# Altium project 18f97j60.PrjPCB
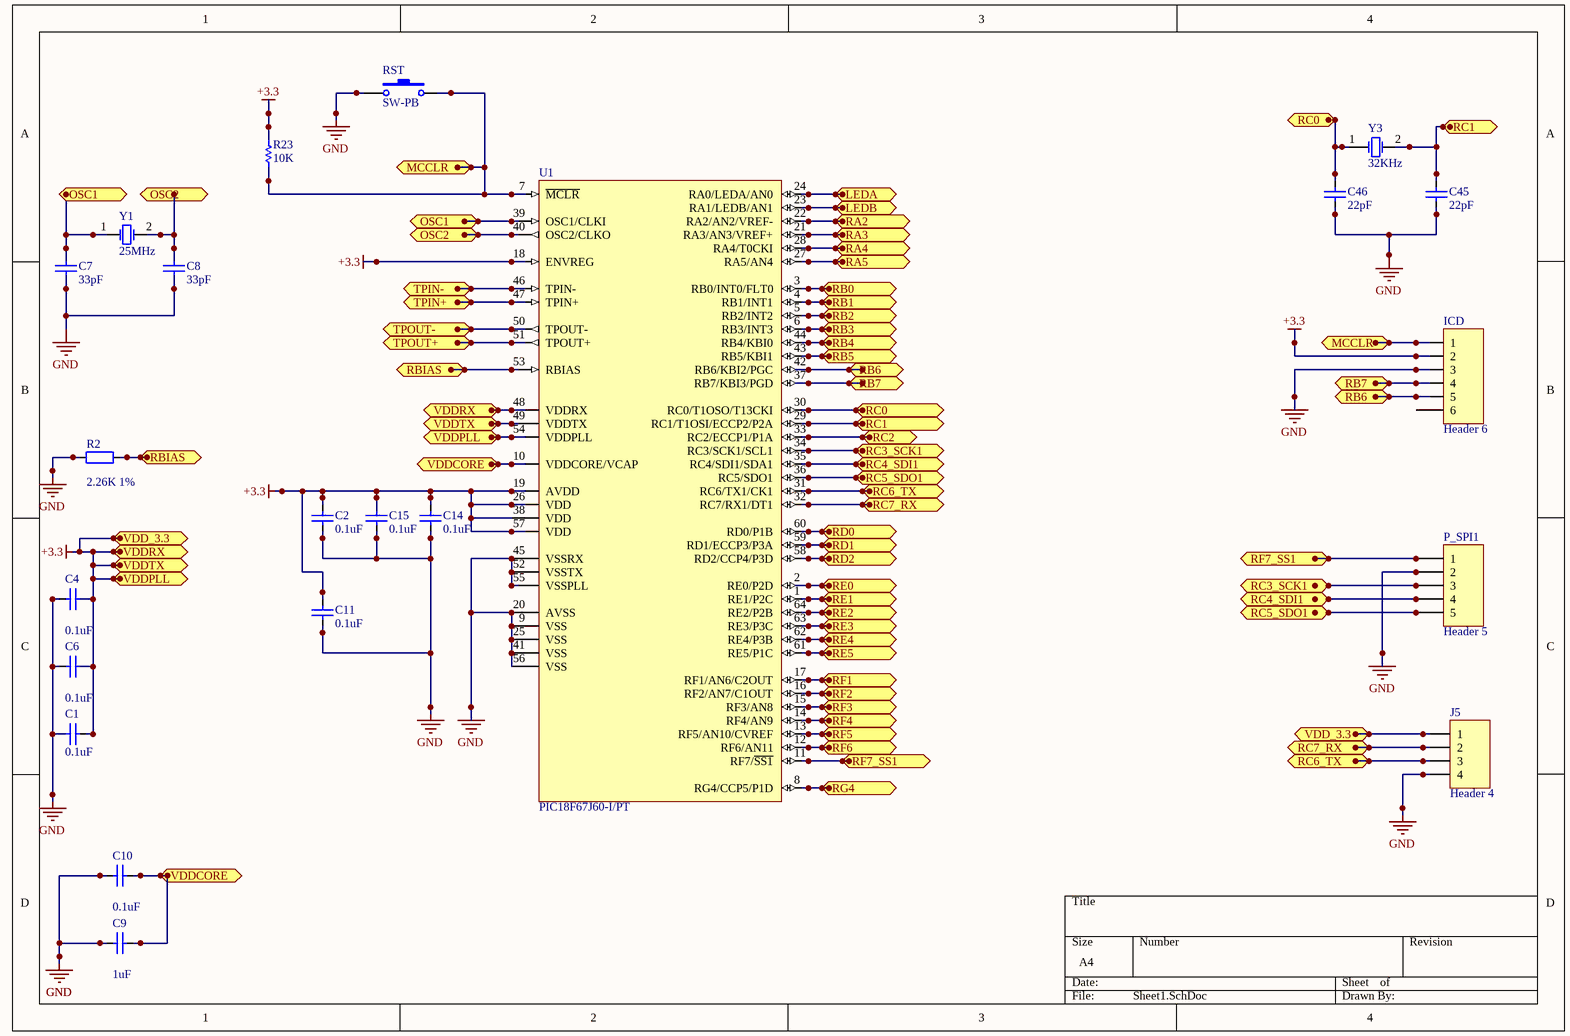
[diagram p0: Sheet1.SchDoc]
2 sheets, 55 parts. Net scope: flat (ports and power ports of the same name join across sheets).
Board file: PCB1.PcbDoc
Sheets:
  Sheet1.SchDoc
  Sheet_MAGJACK.SchDoc

## Sheet Sheet1.SchDoc
size A4

### Parts
C1  0.1uF  [CAPC2012L]
C2  0.1uF  [CAPC2012L]
C4  0.1uF  [CAPC2012L]
C6  0.1uF  [CAPC2012L]
C7  33pF  [CAPC2012L]
C8  33pF  [CAPC2012L]
C9  1uF  [CAPC2012L]
C10  0.1uF  [CAPC2012L]
C11  0.1uF  [CAPC2012L]
C14  0.1uF  [CAPC2012L]
C15  0.1uF  [CAPC2012L]
C45  22pF  [CAPC2012L]
C46  22pF  [CAPC2012L]
ICD  Header 6  [HDR1X6]
J5  Header 4  [HDR1X4]
P_SPI1  Header 5  [HDR1X5]
R2  2.26K 1%  [RESC2012L]
R23  10K  [RESC3216L]
RST  SW-PB  [SPST-2]
U1  PIC18F67J60-I/PT  [TQFP-PT64_L]
Y1  25MHz  [SPST-2]
Y3  32KHz  [BCY-W2/D3.1]

### Ports
LEDA, LEDB, MCCLR, OSC1, OSC2, RA2, RA3, RA4, RA5, RB0, RB1, RB2, RB3, RB4, RB5, RB6, RB7, RBIAS (in), RBIAS (out), RC0, RC1, RC2, RC3_SCK1, RC4_SDI1, RC5_SDO1, RC6_TX, RC7_RX, RD0, RD1, RD2, RE0, RE1, RE2, RE3, RE4, RE5, RF1, RF2, RF3, RF4, RF5, RF6, RF7_SS1, RG4, TPIN+, TPIN-, TPOUT+, TPOUT-, VDD_3.3, VDDCORE, VDDPLL, VDDRX, VDDTX

### Nets
+3.3: C1.2 C2.2 C4.2 C6.2 C11.2 C14.2 C15.2 ICD.2 J5.1 R23.2 U1.18(ENVREG) U1.19(AVDD) U1.26(VDD) U1.38(VDD) U1.48(VDDRX) U1.49(VDDTX) U1.54(VDDPLL) U1.57(VDD) ; port VDDRX, port VDDTX, port VDDPLL, port VDD_3.3
GND: C1.1 C2.1 C4.1 C6.1 C7.1 C8.1 C9.1 C10.1 C11.1 C14.1 C15.1 C45.1 C46.1 ICD.3 J5.4 P_SPI1.2 R2.1 RST.1 U1.9(VSS) U1.20(AVSS) U1.25(VSS) U1.41(VSS) U1.45(VSSRX) U1.52(VSSTX) U1.55(VSSPLL) U1.56(VSS)
NetC7_2: C7.2 Y1.1(OSC1)
NetC8_2: C8.2 Y1.2(OSC2)
NetC9_2: C9.2 C10.2 U1.10(VDDCORE/VCAP) ; port VDDCORE
NetC45_2: C45.2 U1.29(RC1/T1OSI/ECCP2/P2A) Y3.2(OSC2) ; port RC1
NetC46_2: C46.2 U1.30(RC0/T1OSO/T13CKI) Y3.1(OSC1) ; port RC0
NetICD_1: ICD.1 R23.1 RST.2 U1.7(~{MCLR}) ; port MCCLR
NetICD_4: ICD.4 U1.37(RB7/KBI3/PGD) ; port RB7
NetICD_5: ICD.5 U1.42(RB6/KBI2/PGC) ; port RB6
NetJ1_1: U1.51(TPOUT+) ; port TPOUT+
NetJ1_2: U1.50(TPOUT-) ; port TPOUT-
NetJ1_7: U1.47(TPIN+) ; port TPIN+
NetJ1_8: U1.46(TPIN-) ; port TPIN-
NetJ1_9: U1.24(RA0/LEDA/AN0) ; port LEDA
NetJ1_12: U1.23(RA1/LEDB/AN1) ; port LEDB
NetJ5_2: J5.2 U1.32(RC7/RX1/DT1) ; port RC7_RX
NetJ5_3: J5.3 U1.31(RC6/TX1/CK1) ; port RC6_TX
NetJAPORT_1: U1.21(RA3/AN3/VREF+) ; port RA3
NetJAPORT_2: U1.22(RA2/AN2/VREF-) ; port RA2
NetJAPORT_3: U1.27(RA5/AN4) ; port RA5
NetJAPORT_4: U1.28(RA4/T0CKI) ; port RA4
NetJFPORT_1: U1.17(RF1/AN6/C2OUT) ; port RF1
NetJFPORT_2: U1.16(RF2/AN7/C1OUT) ; port RF2
NetJFPORT_3: U1.15(RF3/AN8) ; port RF3
NetJFPORT_4: U1.14(RF4/AN9) ; port RF4
NetJFPORT_5: U1.13(RF5/AN10/CVREF) ; port RF5
NetJFPORT_6: U1.12(RF6/AN11) ; port RF6
NetP_M1_1: U1.63(RE3/P3C) ; port RE3
NetP_M1_2: U1.62(RE4/P3B) ; port RE4
NetP_M1_3: U1.61(RE5/P1C) ; port RE5
NetP_M1_4: U1.60(RD0/P1B) ; port RD0
NetP_M1_5: U1.59(RD1/ECCP3/P3A) ; port RD1
NetP_M1_6: U1.58(RD2/CCP4/P3D) ; port RD2
NetP_M1_7: U1.44(RB4/KBI0) ; port RB4
NetP_M1_8: U1.43(RB5/KBI1) ; port RB5
NetP_M2_1: U1.8(RG4/CCP5/P1D) ; port RG4
NetP_M2_2: U1.6(RB3/INT3) ; port RB3
NetP_M2_3: U1.5(RB2/INT2) ; port RB2
NetP_M2_4: U1.4(RB1/INT1) ; port RB1
NetP_M2_5: U1.3(RB0/INT0/FLT0) ; port RB0
NetP_M2_6: U1.2(RE0/P2D) ; port RE0
NetP_M2_7: U1.1(RE1/P2C) ; port RE1
NetP_M2_8: U1.64(RE2/P2B) ; port RE2
NetP_SPI1_1: P_SPI1.1 U1.11(RF7/~{SS1}) ; port RF7_SS1
NetP_SPI1_3: P_SPI1.3 U1.34(RC3/SCK1/SCL1) ; port RC3_SCK1
NetP_SPI1_4: P_SPI1.4 U1.35(RC4/SDI1/SDA1) ; port RC4_SDI1
NetP_SPI1_5: P_SPI1.5 U1.36(RC5/SDO1) ; port RC5_SDO1
NetR2_2: R2.2 U1.53(RBIAS) ; port RBIAS
NetR6_1: U1.33(RC2/ECCP1/P1A) ; port RC2
NetU1_39: U1.39(OSC1/CLKI) ; port OSC1
NetU1_40: U1.40(OSC2/CLKO) ; port OSC2

Not connected (* = marked no-connect by the designer): ICD 6

### Library data of the parts
C1 C45 C46 = Cap Semi: Capacitor (Semiconductor SIM Model); Published: 8-Jun-2000; LatestRevisionDate: 29-May-2009; LatestRevisionNote: IPC-7351 Footprint Added.; PackageReference: C1206; Publisher: Altium Limited; PackageDescription: Chip Capacitor
  C1: Value: 0.1uF
  C45 C46: Value: 22pF
C2 C4 C6-C11 C14 C15 = Cap: Capacitor; Published: 8-Jun-2000; LatestRevisionDate: 17-Jul-2002; LatestRevisionNote: Re-released for DXP Platform.; PackageReference: RAD-0.3; Publisher: Altium Limited
  C2 C4 C6 C10 C11 C14 C15: Value: 0.1uF
  C7 C8: Value: 33pF
  C9: Value: 1uF
ICD = Header 6: Header, 6-Pin; LatestRevisionDate: 17-Jul-2002; LatestRevisionNote: Re-released for DXP Platform.; Publisher: Altium Limited
J5 = Header 4: Header, 4-Pin; LatestRevisionDate: 17-Jul-2002; LatestRevisionNote: Re-released for DXP Platform.; Publisher: Altium Limited
P_SPI1 = Header 5: Header, 5-Pin; LatestRevisionDate: 17-Jul-2002; LatestRevisionNote: Re-released for DXP Platform.; Publisher: Altium Limited
R2 = Res2: Resistor; Published: 8-Jun-2000; LatestRevisionDate: 17-Jul-2002; LatestRevisionNote: Re-released for DXP Platform.; PackageReference: AXIAL-0.4; Publisher: Altium Limited; Value: 2.26K 1%
R23 = Res Semi: Semiconductor Resistor; Published: 8-Jun-2000; LatestRevisionDate: 17-Jul-2002; LatestRevisionNote: Re-released for DXP Platform.; PackageReference: AXIAL-0.5; Publisher: Altium Limited; Value: 10K
RST = SW-PB: Switch; Published: 24-Mar-1999; LatestRevisionDate: 17-Jul-2002; LatestRevisionNote: Re-released for DXP Platform.; PackageReference: SPST-2; Publisher: Altium Limited
U1 = PIC18F67J60-I/PT: High Performance, 1-Mbit Flash Microcontroller with Ethernet, 128K Flash, 64-Pin TQFP, Industrial Temperature Range; FirstPublished: 29-Jan-2009; LatestRevisionDate: 02-Dec-2009; LatestRevisionNote: Updated to datasheet revision E, Oct-2009; DatasheetVersion: revE, Oct-2009; PackageVersion: revBB, Aug-2009; PackageReference: TQFP-PT64; Publisher: Altium Limited; PackageDescription: 64-Lead Thin Plastic Quad Flat Pack (PT) - 10x10x1mm Body, 2.00mm [TQFP]; Supplier 1: Digi-Key; Supplier Part Number 1: PIC18F67J60-I/PT-ND; Supplier 2: Farnell; Supplier Part Number 2: 1332285; Supplier 3: Newark; Supplier Part Number 3: 56K7302; Code_JEDEC: MS-026; ComponentLink1Description: Datasheet; ComponentLink1URL: http://ww1.microchip.com/downloads/en/DeviceDoc/39762e.pdf; ComponentLink2Description: Packaging Specification; ComponentLink2URL: http://www.microchip.com/stellent/groups/techpub_sg/documents/packagingspec/en012702.pdf; ComponentLink3Description: Microchip.com Home; ComponentLink3URL: http://www.microchip.com/
Y1 Y3 = XTAL: Crystal Oscillator; Published: 8-Jun-2000; LatestRevisionDate: 17-Jul-2002; LatestRevisionNote: Re-released for DXP Platform.; PackageReference: R38; Publisher: Altium Limited

## Sheet Sheet_MAGJACK.SchDoc
size A4
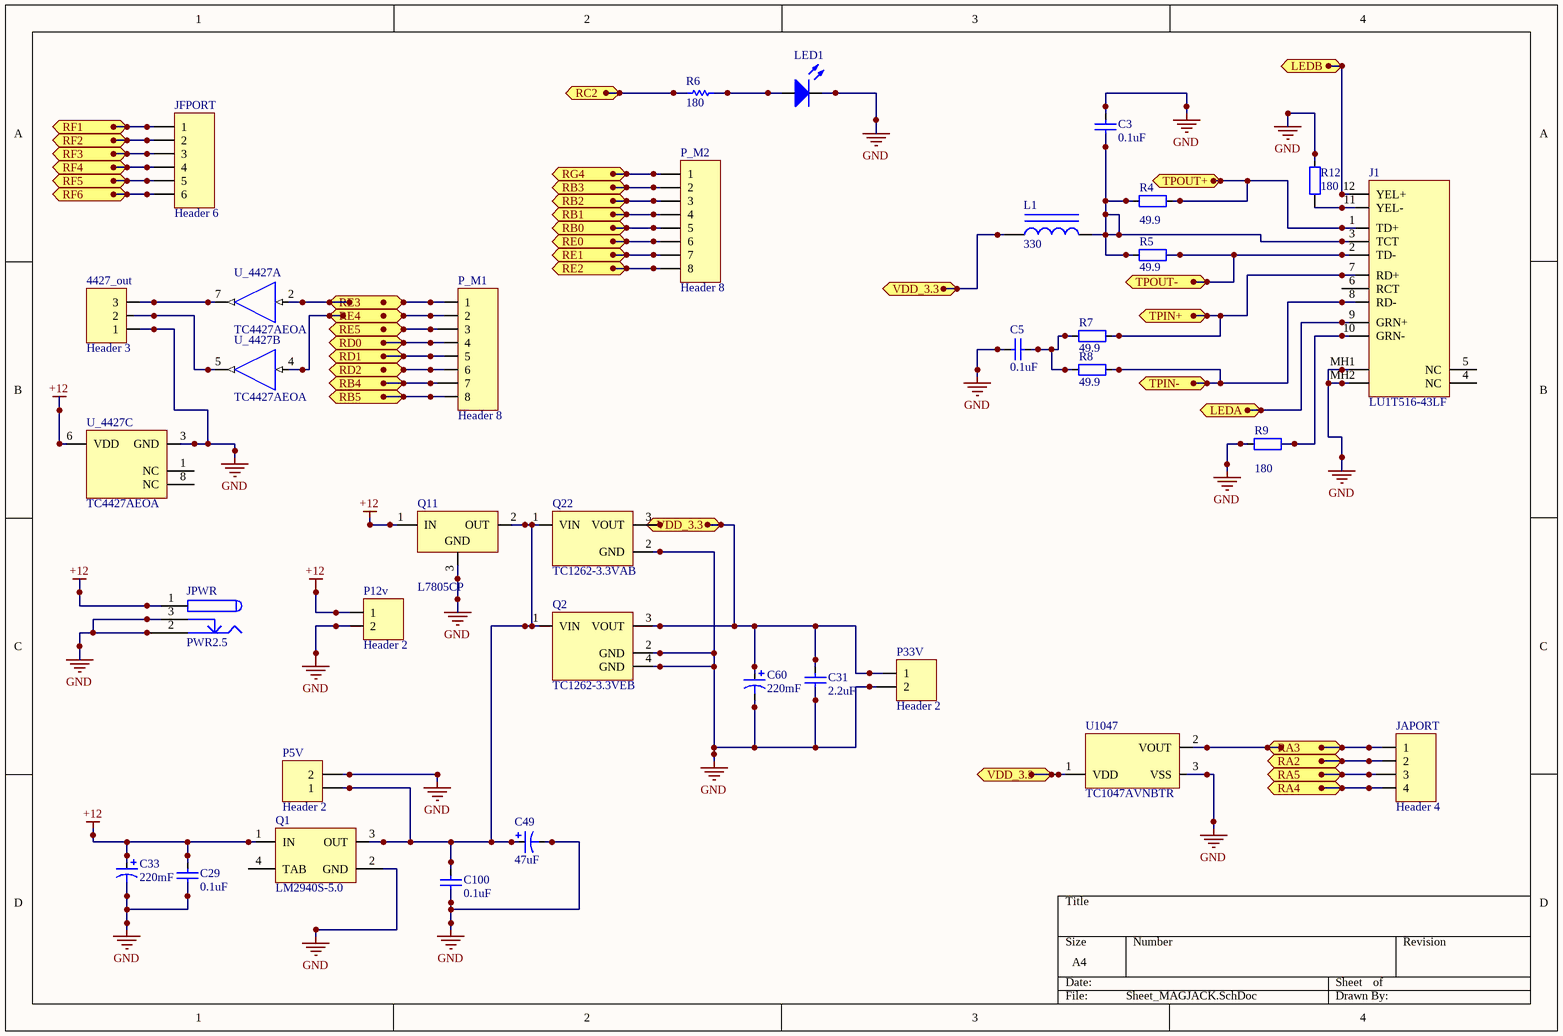
[diagram p1: Sheet_MAGJACK.SchDoc]

### Parts
4427_out  Header 3  [BIG4]
C3  0.1uF  [CAPC2012L]
C5  0.1uF  [CAPC2012L]
C29  0.1uF  [CAPC2012L]
C31  2.2uF  [CAPC3216L]
C33  220mF  [CAPPR5-10x12.5]
C49  47uF  [NSOALUMB]
C60  220mF  [CAPPR5-10x12.5]
C100  0.1uF  [CAPC2012L]
J1  LU1T516-43LF  [CON_RJ45_RA_LEDS]
JAPORT  Header 4  [HDR1X4]
JFPORT  Header 6  [HDR1X6]
JPWR  PWR2.5  [KLD-0202]
L1  330  [RESC2012L]
LED1  LED2  [CAPC2012L]  (value not drawn)
P5V  Header 2  [HDR1X2]
P12v  Header 2  [HDR1X2]
P33V  Header 2  [HDR1X2]
P_M1  Header 8  [HDR1X8]
P_M2  Header 8  [HDR1X8]
Q1  LM2940S-5.0  [TS3B_N]
Q2  TC1262-3.3VEB  [DDPAK-EB3_N]
Q11  L7805CP  [ISOWATT220AB]
Q22  TC1262-3.3VAB  [TO-220-AB3]
R4  49.9  [RESC2012L]
R5  49.9  [RESC2012L]
R6  180  [RESC2012L]
R7  49.9  [RESC2012L]
R8  49.9  [RESC2012L]
R9  180  [RESC2012L]
R12  180  [RESC2012L]
U1047  TC1047AVNBTR  [SOT-23-NB3_N]
U_4427  TC4427AEOA  [SOIC-OA8_N]  (parts A,B,C of 3)

### Ports
LEDA, LEDB, RA2, RA3, RA4, RA5, RB0, RB1, RB2, RB3, RB4, RB5, RC2, RD0, RD1, RD2, RE0, RE1, RE2, RE3, RE4, RE5, RF1, RF2, RF3, RF4, RF5, RF6, RG4, TPIN+, TPIN-, TPOUT+, TPOUT-, VDD_3.3

### Nets
+3.3: C31.2 C60.1 L1.1 P33V.1 Q2.3(VOUT) U1047.1(VDD) ; port VDD_3.3
+12: C29.2 C33.1 JPWR.1 JPWR.1A JPWR.1B P12v.1 Q1.1(IN) Q11.1(IN) U_4427.6(VDD)
GND: 4427_out.1 C3.2 C5.1 C29.1 C31.1 C33.2 C49.2 C60.2 C100.1 J1.MH1 J1.MH2 JPWR.2 JPWR.2A JPWR.2B JPWR.3 JPWR.3A JPWR.3B LED1.2(K) P5V.2 P12v.2 P33V.2 Q1.2(GND) Q2.2(GND) Q2.4(GND) Q11.3(GND) Q22.2(GND) R9.1 R12.2 U1047.3(VSS) U_4427.3(GND)
Net4427_out_2: 4427_out.2 U_4427.5(OUTB)
Net4427_out_3: 4427_out.3 U_4427.7(OUTA)
NetC3_1: C3.1 J1.3(TCT) L1.2 R4.1 R5.1
NetC5_2: C5.2 R7.1 R8.1
NetC49_1: C49.1 C100.2 P5V.1 Q1.3(OUT) Q2.1(VIN) Q11.2(OUT) Q22.1(VIN)
NetJ1_1: J1.1(TD+) R4.2 ; port TPOUT+
NetJ1_2: J1.2(TD-) R5.2 ; port TPOUT-
NetJ1_7: J1.7(RD+) R7.2 ; port TPIN+
NetJ1_8: J1.8(RD-) R8.2 ; port TPIN-
NetJ1_9: J1.9(GRN+) ; port LEDA
NetJ1_10: J1.10(GRN-) R9.2
NetJ1_11: J1.11(YEL-) R12.1
NetJ1_12: J1.12(YEL+) ; port LEDB
NetJAPORT_1: JAPORT.1 U1047.2(VOUT) ; port RA3
NetJAPORT_2: JAPORT.2 ; port RA2
NetJAPORT_3: JAPORT.3 ; port RA5
NetJAPORT_4: JAPORT.4 ; port RA4
NetJFPORT_1: JFPORT.1 ; port RF1
NetJFPORT_2: JFPORT.2 ; port RF2
NetJFPORT_3: JFPORT.3 ; port RF3
NetJFPORT_4: JFPORT.4 ; port RF4
NetJFPORT_5: JFPORT.5 ; port RF5
NetJFPORT_6: JFPORT.6 ; port RF6
NetLED1_1: LED1.1(A) R6.2
NetP_M1_1: P_M1.1 U_4427.2(INA) ; port RE3
NetP_M1_2: P_M1.2 U_4427.4(INB) ; port RE4
NetP_M1_3: P_M1.3 ; port RE5
NetP_M1_4: P_M1.4 ; port RD0
NetP_M1_5: P_M1.5 ; port RD1
NetP_M1_6: P_M1.6 ; port RD2
NetP_M1_7: P_M1.7 ; port RB4
NetP_M1_8: P_M1.8 ; port RB5
NetP_M2_1: P_M2.1 ; port RG4
NetP_M2_2: P_M2.2 ; port RB3
NetP_M2_3: P_M2.3 ; port RB2
NetP_M2_4: P_M2.4 ; port RB1
NetP_M2_5: P_M2.5 ; port RB0
NetP_M2_6: P_M2.6 ; port RE0
NetP_M2_7: P_M2.7 ; port RE1
NetP_M2_8: P_M2.8 ; port RE2
NetR6_1: R6.1 ; port RC2

Not connected (* = marked no-connect by the designer): J1 4(NC) 5(NC) 6(RCT); Q1 4(TAB); Q22 3(VOUT); U_4427 1(NC) 8(NC)

### Library data of the parts
4427_out = Header 3: Header, 3-Pin; LatestRevisionDate: 17-Jul-2002; LatestRevisionNote: Re-released for DXP Platform.; Publisher: Altium Limited
C3 C5 C29 C31 = Cap: Capacitor; Published: 8-Jun-2000; LatestRevisionDate: 17-Jul-2002; LatestRevisionNote: Re-released for DXP Platform.; PackageReference: RAD-0.3; Publisher: Altium Limited
  C3 C5 C29: Value: 0.1uF
  C31: Value: 2.2uF
C33 C49 C60 = Cap Pol1: Polarized Capacitor (Radial); Published: 8-Jun-2000; LatestRevisionDate: 17-Jul-2002; LatestRevisionNote: Re-released for DXP Platform.; PackageReference: RB7.6-15; Publisher: Altium Limited
  C33 C60: Value: 220mF
  C49: Value: 47uF
C100 = Cap Semi: Capacitor (Semiconductor SIM Model); Published: 8-Jun-2000; LatestRevisionDate: 29-May-2009; LatestRevisionNote: IPC-7351 Footprint Added.; PackageReference: C1206; Publisher: Altium Limited; PackageDescription: Chip Capacitor; Value: 0.1uF
J1 = Component_1
JAPORT = Header 4: Header, 4-Pin; LatestRevisionDate: 17-Jul-2002; LatestRevisionNote: Re-released for DXP Platform.; Publisher: Altium Limited
JFPORT = Header 6: Header, 6-Pin; LatestRevisionDate: 17-Jul-2002; LatestRevisionNote: Re-released for DXP Platform.; Publisher: Altium Limited
JPWR = PWR2.5: DC Power Jack, 2.5mm, KLD Series, PCB Mount; Published: 5-Jan-2004; DatasheetDocument: 09-May-2002; Publisher: Altium Limited
L1 = Inductor Iron: Magnetic-Core Inductor; Published: 24-Mar-1999; LatestRevisionDate: 17-Jul-2002; LatestRevisionNote: Re-released for DXP Platform.; PackageReference: AXIAL-0.9; Publisher: Altium Limited; Value: 330
LED1 = LED2: Typical RED, GREEN, YELLOW, AMBER GaAs LED; Published: 8-Jun-2000; LatestRevisionDate: 17-Jul-2002; LatestRevisionNote: Re-released for DXP Platform.; PackageReference: 3.2X1.6X1.1; Publisher: Altium Limited; PackageVersion: Feb-2002
P5V P12v P33V = Header 2: Header, 2-Pin; LatestRevisionDate: 17-Jul-2002; LatestRevisionNote: Re-released for DXP Platform.; Publisher: Altium Limited
P_M1 P_M2 = Header 8: Header, 8-Pin; LatestRevisionDate: 17-Jul-2002; LatestRevisionNote: Re-released for DXP Platform.; Publisher: Altium Limited
Q1 = LM2940S-5.0: 1A Low Dropout Regulator; Manufacturer: National Semiconductor; CompType: LDO IC; PackageTopMarking: NSUZXYTTE#*LM2940S*-5.0 P+; PowerWise: N; Published: 4-Dec-2008; DatasheetVersion: Jan-2007; PackageVersion: revF, Apr-2005; PackageReference: TS3B; Publisher: Altium Limited; PackageDescription: TO-263, Molded, .400 x .390 x .180in, 3 Lead, .1in Pitch, Surface Mount; PartNumber: LM2940S-5.0; RoHS: O; PinCount: 3; DigiKeyPartNumber: LM2940S-5.0-ND; Code_JEDEC: MO-169-AA; ComponentLink1Description: LM2940 Datasheet; ComponentLink1URL: http://www.national.com/ds/LM/LM2940.pdf; ComponentLink2Description: LM2940 Web Page; ComponentLink2URL: http://www.national.com/pf/LM/LM2940.html; ComponentLink3Description: TS3B Package Page; ComponentLink3URL: http://www.national.com/packaging/folders/ts3b.html
Q2 = TC1262-3.3VEB: 500mA Fixed Output CMOS LDO, 3-Pin DDPAK, Extended Temperature; FirstPublished: 29-Jan-2009; DatasheetVersion: revB, 2002; PackageVersion: revBB, Aug-2009; PackageReference: DDPAK-EB3; Publisher: Altium Limited; PackageDescription: 3-Lead Plastic (EB) [DDPAK]; ComponentLink1Description: Datasheet; ComponentLink1URL: http://ww1.microchip.com/downloads/en/DeviceDoc/21373b.pdf; ComponentLink2Description: Packaging Specification; ComponentLink2URL: http://www.microchip.com/stellent/groups/techpub_sg/documents/packagingspec/en012702.pdf; ComponentLink3Description: Microchip.com Home; ComponentLink3URL: http://www.microchip.com/
Q11 = L7805CP: Positive Voltage Regulator; Note: Tab is connected to pin 3 (GND).; Published: 24-Aug-2001; LatestRevisionDate: 17-Jul-2002; LatestRevisionNote: Re-released for DXP Platform.; DatasheetVersion: Dec-1998; PackageVersion: Jul-1998; PackageReference: ISOWATT220AB; Publisher: Altium Limited; PackageDescription: TO, Thru-Hole, Vertical, Heatsink Mounted; 3 In-Line Leads; Pitch 2.54 mm; Pin sequence 1, 3, 2; ComponentLink1Description: Manufacturer Link; ComponentLink1URL: http://www.st.com/
Q22 = TC1262-3.3VAB: 500mA Fixed Output CMOS LDO, 3-Pin TO-220, Extended Temperature; FirstPublished: 29-Jan-2009; DatasheetVersion: revB, 2002; PackageVersion: revBB, Aug-2009; PackageReference: TO-220-AB3; Publisher: Altium Limited; PackageDescription: 3-Lead Plastic Transistor Outline (AB) [TO-220]; Supplier 1: Digi-Key; Supplier Part Number 1: TC1262-3.3VAB-ND; Supplier 2: Newark; Supplier Part Number 2: 92C5755; ComponentLink1Description: Datasheet; ComponentLink1URL: http://ww1.microchip.com/downloads/en/DeviceDoc/21373b.pdf; ComponentLink2Description: Packaging Specification; ComponentLink2URL: http://www.microchip.com/stellent/groups/techpub_sg/documents/packagingspec/en012702.pdf; ComponentLink3Description: Microchip.com Home; ComponentLink3URL: http://www.microchip.com/
R4 R5 R7-R9 R12 = Res2: Resistor; Published: 8-Jun-2000; LatestRevisionDate: 17-Jul-2002; LatestRevisionNote: Re-released for DXP Platform.; PackageReference: AXIAL-0.4; Publisher: Altium Limited
  R4 R5 R7 R8: Value: 49.9
  R9 R12: Value: 180
R6 = Res Semi: Semiconductor Resistor; Published: 8-Jun-2000; LatestRevisionDate: 17-Jul-2002; LatestRevisionNote: Re-released for DXP Platform.; PackageReference: AXIAL-0.5; Publisher: Altium Limited; Value: 180
U1047 = TC1047AVNBTR: Precision Temperature-to-Voltage Converter, 3-Pin SOT-23, Extended Temperature, Tape and Reel; FirstPublished: 29-Jan-2009; DatasheetVersion: revC, May-2005; PackageVersion: revBB, Aug-2009; PackageReference: SOT-23-NB3; Publisher: Altium Limited; PackageDescription: 3-Lead Plastic Small Outline Transistor (NB) [SOT-23]; Supplier 1: Digi-Key; Supplier Part Number 1: TC1047AVNBTR-ND; Supplier 2: Digi-Key; Supplier Part Number 2: TC1047AVNBCT-ND; Supplier 3: Digi-Key; Supplier Part Number 3: TC1047AVNBDKR-ND; Supplier 4: Farnell; Supplier Part Number 4: 9762531; Supplier 5: Newark; Supplier Part Number 5: 89C8093; Code_IPC: SOT23-3; ComponentLink1Description: Datasheet; ComponentLink1URL: http://ww1.microchip.com/downloads/en/DeviceDoc/21498C.pdf; ComponentLink2Description: Packaging Specification; ComponentLink2URL: http://www.microchip.com/stellent/groups/techpub_sg/documents/packagingspec/en012702.pdf; ComponentLink3Description: Microchip.com Home; ComponentLink3URL: http://www.microchip.com/
U_4427 = TC4427AEOA: 1.5A Dual High-Speed Power MOSFET Driver, Non-Inverting, Industrial Temperature; FirstPublished: 29-Jan-2009; DatasheetVersion: revF, Jan-2006; PackageVersion: revBB, Aug-2009; PackageReference: SOIC-OA8; Publisher: Altium Limited; PackageDescription: 8-Lead Plastic Small Outline (OA) - Narrow, 3.90mm Body [SOIC]; Supplier 1: Digi-Key; Supplier Part Number 1: TC4427AEOA-ND; Supplier 2: Farnell; Supplier Part Number 2: 1292285; Supplier 3: Newark; Supplier Part Number 3: 96K4020; Code_IPC: SOIC127P600-8; ComponentLink1Description: Datasheet; ComponentLink1URL: http://ww1.microchip.com/downloads/en/DeviceDoc/21423F.pdf; ComponentLink2Description: Packaging Specification; ComponentLink2URL: http://www.microchip.com/stellent/groups/techpub_sg/documents/packagingspec/en012702.pdf; ComponentLink3Description: Microchip.com Home; ComponentLink3URL: http://www.microchip.com/

## Nets that join several sheets
+3.3: Sheet1 (18 pins), Sheet_MAGJACK (6 pins)
GND: Sheet1 (26 pins), Sheet_MAGJACK (30 pins)
NetJ1_1: Sheet1 (U1.51), Sheet_MAGJACK (J1.1 R4.2)
NetJ1_2: Sheet1 (U1.50), Sheet_MAGJACK (J1.2 R5.2)
NetJ1_7: Sheet1 (U1.47), Sheet_MAGJACK (J1.7 R7.2)
NetJ1_8: Sheet1 (U1.46), Sheet_MAGJACK (J1.8 R8.2)
NetJ1_9: Sheet1 (U1.24), Sheet_MAGJACK (J1.9)
NetJ1_12: Sheet1 (U1.23), Sheet_MAGJACK (J1.12)
NetJAPORT_1: Sheet1 (U1.21), Sheet_MAGJACK (JAPORT.1 U1047.2)
NetJAPORT_2: Sheet1 (U1.22), Sheet_MAGJACK (JAPORT.2)
NetJAPORT_3: Sheet1 (U1.27), Sheet_MAGJACK (JAPORT.3)
NetJAPORT_4: Sheet1 (U1.28), Sheet_MAGJACK (JAPORT.4)
NetJFPORT_1: Sheet1 (U1.17), Sheet_MAGJACK (JFPORT.1)
NetJFPORT_2: Sheet1 (U1.16), Sheet_MAGJACK (JFPORT.2)
NetJFPORT_3: Sheet1 (U1.15), Sheet_MAGJACK (JFPORT.3)
NetJFPORT_4: Sheet1 (U1.14), Sheet_MAGJACK (JFPORT.4)
NetJFPORT_5: Sheet1 (U1.13), Sheet_MAGJACK (JFPORT.5)
NetJFPORT_6: Sheet1 (U1.12), Sheet_MAGJACK (JFPORT.6)
NetP_M1_1: Sheet1 (U1.63), Sheet_MAGJACK (P_M1.1 U_4427.2)
NetP_M1_2: Sheet1 (U1.62), Sheet_MAGJACK (P_M1.2 U_4427.4)
NetP_M1_3: Sheet1 (U1.61), Sheet_MAGJACK (P_M1.3)
NetP_M1_4: Sheet1 (U1.60), Sheet_MAGJACK (P_M1.4)
NetP_M1_5: Sheet1 (U1.59), Sheet_MAGJACK (P_M1.5)
NetP_M1_6: Sheet1 (U1.58), Sheet_MAGJACK (P_M1.6)
NetP_M1_7: Sheet1 (U1.44), Sheet_MAGJACK (P_M1.7)
NetP_M1_8: Sheet1 (U1.43), Sheet_MAGJACK (P_M1.8)
NetP_M2_1: Sheet1 (U1.8), Sheet_MAGJACK (P_M2.1)
NetP_M2_2: Sheet1 (U1.6), Sheet_MAGJACK (P_M2.2)
NetP_M2_3: Sheet1 (U1.5), Sheet_MAGJACK (P_M2.3)
NetP_M2_4: Sheet1 (U1.4), Sheet_MAGJACK (P_M2.4)
NetP_M2_5: Sheet1 (U1.3), Sheet_MAGJACK (P_M2.5)
NetP_M2_6: Sheet1 (U1.2), Sheet_MAGJACK (P_M2.6)
NetP_M2_7: Sheet1 (U1.1), Sheet_MAGJACK (P_M2.7)
NetP_M2_8: Sheet1 (U1.64), Sheet_MAGJACK (P_M2.8)
NetR6_1: Sheet1 (U1.33), Sheet_MAGJACK (R6.1)